# Altium schematic sheet Antenna_Supervisor.SchDoc
size A; sch_PageDescription: sch_PageDescription; sch_PageTitle: sch_PageTitle; Organization: ORGANIZATION; Address1: ADDRESS 1; Address2: ADDRESS 2; Address3: ADDRESS 3; Address4: ADDRESS 4; Revision: -; SheetNumber: 3; SheetTotal: 3; ENG_APP_DATE: --/--/--; DSN_APP_DATE: --/--/--; CHK_APP_DATE: --/--/--; SPICEModelCachePIVZSDOR: <root> / <DocumentId>PIVZSDOR</DocumentId> / <CacheFrame Number="0"> / <Model Name="umk105bj104_v-f" Kind="CKT"> / <Text>* UMK105BJ104_V-F     SPICE MODEL  ( General Type ) / *-------------------------------------------------------------------------------------------------------- / * Model Generated by TAIYO YUDEN Corporation (http://www.ty-top.com) / * Version 1.0 / * TAIYO YUDEN Control No. 170508_120810 / * Copyright(c) 2012 TAIYO YUDEN CO.,LTD. All Rights Reserved. / *-------------------------------------------------------------------------------------------------------- / * / * Products Name : Multilayer Ceramic Capacitors / * / * Characteristics : / *     Capacitance : 0.1 uF , Rated Voltage : 50V , TCC : X5R / *     Case Size : 1.0 x 0.5 / 0.039 x 0.02 [mm/inch] , Thickness : 0.5 / 0.02 [mm/inch] / *     (Conditions: Temperature = 25 degC , DC Bias Current/Voltage = 0A / 0V) / * / * Frequency Range : 40Hz - 3GHz / * / * External Node Assignments : / * / *  1  o---| |---o  2 / * / *-------------------------------------------------------------------------------------------------------- / .SubCkt UMK105BJ104_V-F 1 2 / **************************** / C0 1 110 0.068998u / Cm 1 101 0.01292u / C1 101 102 0.041907u / Rc1 101 102 25.432k / C2 102 103 0.021417u / Rc2 102 103 1.1926k / C3 103 110 0.016759u / Rc3 103 110 12.415 / C2m 1 301 0.022631u / C21 301 302 0.1608u / Rc21 301 302 202.11k / C22 302 303 0.054305u / Rc22 302 303 87.274k / C23 303 304 0.14296u / Rc23 303 304 7.7387k / C24 304 305 0.08092u / Rc24 304 305 2.9339k / C25 305 306 0.04951u / Rc25 305 306 2.1733k / C26 306 307 0.043691u / Rc26 306 307 191.91 / C27 307 308 0.016759u / Rc27 307 308 147.23 / C28 308 309 5027.4p / Rc28 308 309 97.746 / C29 309 110 570.66p / Rc29 309 110 12.365 / Rp0 1 110 5G / L0 110 120 0.23341n / Lm 120 130 0.14222n / L1 120 121 0.036554n / RL1 121 130 1.698 / L2 120 122 0.11188n / RL2 122 130 0.33926 / L3 120 123 1.1401n / RL3 123 130 1.655 / CR 120 124 0.028892u / LR 124 125 0.10347n / RR 125 130 0.14446 / CL 130 140 2.048p / LL 130 140 0.1545n / RL 130 140 189.66 / Rs 140 2 26.069m / **************************** / .ends UMK105BJ104_V-F</Text> / </Model> / </CacheFrame> / </root>
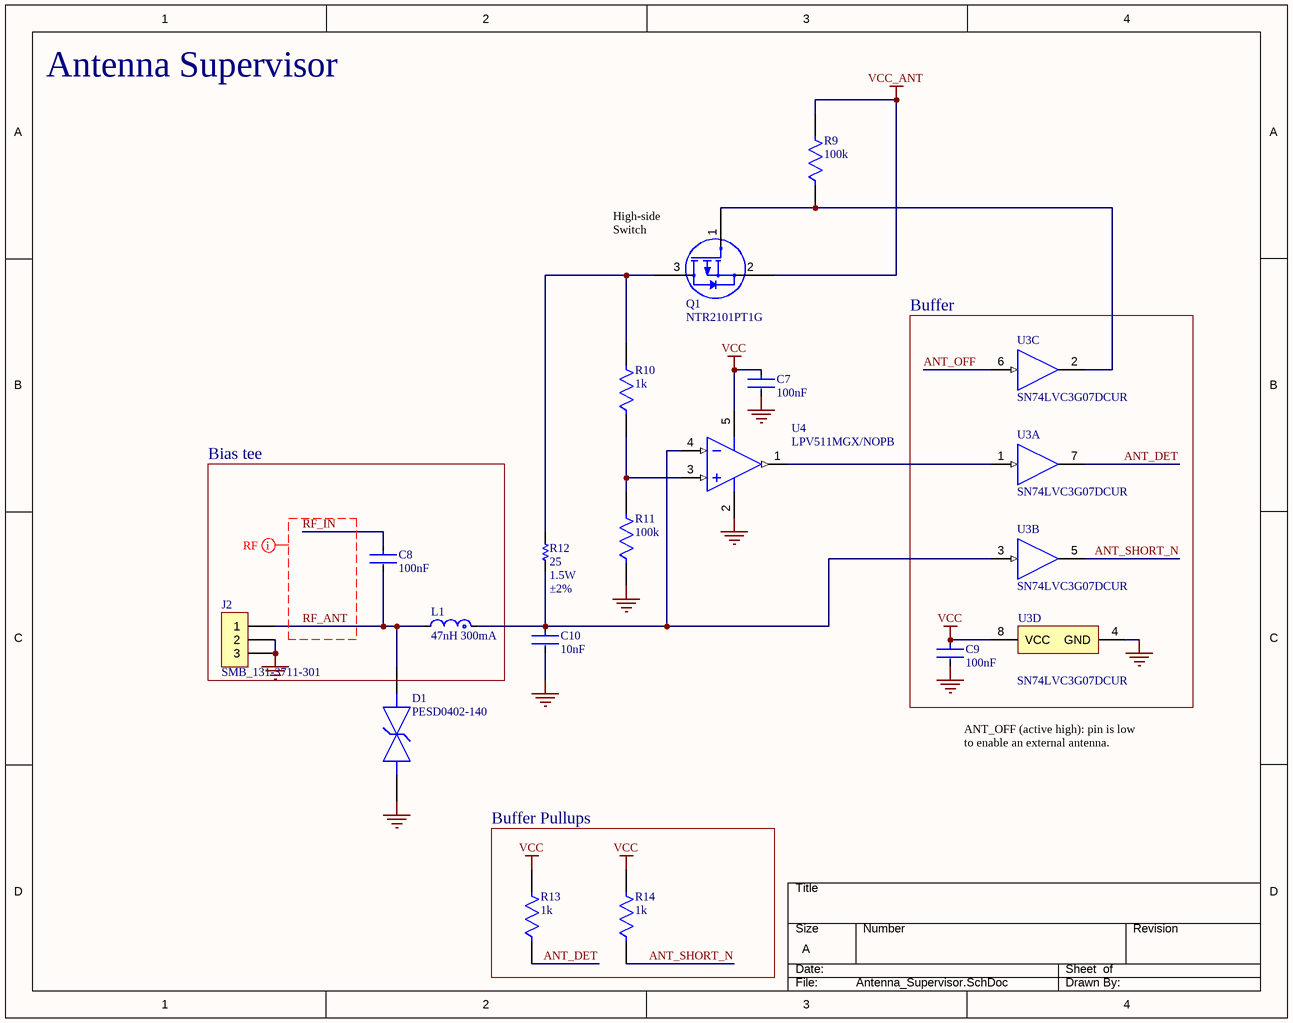
[diagram p0: Antenna_Supervisor.SchDoc]

## Parts
C7  100nF  [FP-0402-L_1_0_0_05-W_0_5-IPC_B]
C8  100nF  [FP-0402-L_1_0_0_05-W_0_5-IPC_B]
C9  100nF  [FP-0402-L_1_0_0_05-W_0_5-IPC_B]
C10  10nF  [FP-GRM033-0_03-IPC_B]
D1  PESD0402-140  [FP-PESD0402-MFG]
J2  SMB_131-3711-301  [CONN_131-3711-301]
L1  47nH 300mA  [FP-LQG15HH_02-IPC_B]
Q1  Manufacturer Part Number: NTR2101PT1G  [SOT23_3pins_300x140x112]  (hidden comment: onsemi_NTR2101PT1G)
R9  100k  [FP-RMCF0402-IPC_C]
R10  1k  [FP-RMCF0402-MFG]
R11  100k  [FP-RMCF0402-IPC_C]
R12  Resistance: 25  Power (Watts): 1.5W  Tolerance: ±2%  [RESC1608X055N]  (hidden comment: Vishay_RCP0603W25R0GEB)
R13  1k  [FP-RMCF0402-MFG]
R14  1k  [FP-RMCF0402-MFG]
U3  SN74LVC3G07DCUR  [DCU0008A_N]  (parts A,B,C,D of 4)
U4  LPV511MGX/NOPB  [DCK0005A_N]

## Blocks framed on the sheet
Buffer: C9 U3
Bias tee: C8 J2 L1
Buffer Pullups: R13 R14

## Nets
GND: C7.2 C9.2 C10.2 D1.1 J2.2 J2.3 R11.1 U3.4(GND) U4.2(V-)
VCC: C7.1 C9.1 R13.2 R14.2 U3.8(VCC) U4.5(V+)
VCC_ANT: Q1.2(S) R9.2
ANT_DET: R13.1 U3.7(1Y)
ANT_OFF: U3.6(3A)
ANT_SHORT_N: R14.1 U3.5(2Y)
RF_ANT: C8.2 D1.2 J2.1 L1.2
RF_IN: C8.1
NetC10_1: C10.1 L1.1 R12.2 U3.3(2A) U4.4(IN-)
NetQ1_1: Q1.1(G) R9.1 U3.2(3Y)
NetQ1_3: Q1.3(D) R10.2 R12.1
NetR10_1: R10.1 R11.2 U4.3(IN+)
NetU3_1: U3.1(1A) U4.1(OUT)

## Layout directives
net class RF: RF_ANT, RF_IN

## Notes on the sheet
- Antenna Supervisor
- (near Q1) High-side Switch
- ANT_OFF (active high): pin is low to enable an external antenna.
- DWG. NO.
- REV.
- SHT.
- THIS DOCUMENT AND THE DATA DISCLOSED HEREIN OR HEREWITH IS THE PROPERTY OF ALTIUM LIMITED AND MAY BE FREELY DISTRIBUTED IN WHOLE. NO RIGHTS ARE RESERVED OR EXPRESS OR IMPLIED WARANTEE GIVEN.
- REVISION
- DESCRIPTION
- DATE
- APPROVED
- ENG:
- APPROVALS
- PROJECT
- DSN:
- CHK:
- REFERENCE DOCUMENTS
- PROJECT REVISION:
- TITLE
- DOCUMENT REVISION:
- DESIGN ITEM:
- BOM:
- FAB DWG:
- PCB DWG:
- ASSY DWG:
- SCALE:
- SIZE
- B
- CAGE CODE
- FILE NAME
- DWG NO.
- SHEET
- OF
- REV

## Library data of the parts
C7-C9 = CMP-14477-000330-2: None; Voltage Rating (DC): 50V; Dielectric: X5R; Tolerance: 10%; RoHS Compliant: Yes; Termination: SMD/SMT; Packaging: Tape and Reel; Capacitance: 100nF; Height: 0.5mm; Halogen Free: Halogen Free; Case Code (Metric): 1005; Width: 0.02inch; Max Operating Temperature: 85°C; Voltage Rating: 50V; Min Operating Temperature: -55°C; Package Quantity: 10000; Case/Package: 0402; Case Code (Imperial): 0402; Length: 0.039inch; Thickness: 0.022inch; Mount: Surface Mount
C10 = CMP-03422-000501-1: CAP CER 10000PF 16V X7R 0402; Manufacturer Part Number: CC0402KRX7R7BB103; Manufacturer: YAGEO; Automotive Grade: NA; Material: Ceramic; Tolerance: 0.1; Temperature Coefficient: 30ppm/°C; Description: CC0402 10 nF X7R 10.00% 16 V; Temperature Range Low: -55°C; Temperature Range High: +125°C; Mouser Description: 0402 10 nF 16 V ±10 % Tolerance X7R SMT Multilayer Ceramic Capacitor; Footprint Url: http://www.yageo.com/exep/pages/download/literatures/UPY-C_GEN_24.pdf; Category: Cap; RoHS: TRUE; Capacitance: 10 nF; ComponentLink2Description: Datasheet; Ipc Land Pattern Name: CAPC10050X50; Value: 10 nF; Automotive: No; ComponentLink2URL: http://www.yageo.com/documents/recent/UPY-GP_NP0_16V-to-50V_16.pdf; Device Class L1: Passive Components; Height: 0.55mm; Temperature Characteristic: X7R; Package: CC0402; Voltage Rating: 16 V; Device Class L3: Ceramic Capacitors; Lead Free: Yes; Device Class L2: Capacitors; Digikey Description: CAP CER 10000PF 16V X7R 0402; Octopart: https://octopart.com/cc0402krx7r7bb103-yageo-192895; Temperature: -55°C to +125°C
D1 = CMP-08607-000011-1: TVS DIODE 14V 40V 0402; Manufacturer: Littelfuse Inc.; Automotive Grade: Grade 1; Capacitance: 0.25pF; Value: 0.25pF; Direction: Bidirectional; Number Of Channels: 1; Temperature Range Low: -55°C; Lead Free: Yes; Temperature: -55°C to +125°C; Digikey Description: TVS DIODE 14V 40V 0402; Automotive: Yes; Device Class L2: TVS Diodes; Reverse Standoff Voltage: 14V; Device Class L1: Circuit Protection; Ipc Land Pattern Name: DIOC10050X33; Manufacturer Part Number: PESD0402-140; Breakdown Voltage: 14V; Height: 0.43mm; Clamping Voltage: 40V; RoHS: TRUE; Temperature Range High: +125°C; Device Class L3: unset; Octopart: https://octopart.com/pesd0402-140-littelfuse-74215061; Package: PESD0402; ComponentLink2URL: https://www.littelfuse.com/~/media/electronics/datasheets/polymer_esd_suppressors/littelfuse_polymer_esd_suppressor_pesd_catalog_datasheet.pdf.pdf; Category: Diode; ComponentLink2Description: Datasheet
J2 = CONN_131-3711-301: Rf Coaxial Board Mount Connector; Manufacturer: Bel Cinch; Body Material: Brass; Plating: Nickel; Body Plating: Gold; Dielectric Material: PTFE; Impedance: 50R; Voltage Rating: 335V; Gender: Female; Frequency: 4Hz; Connector Type: SMB,Male Pin; Max Frequency: 4GHz; Polarity: Reverse; Operating Frequency: 0 to 4 Hz to GHz; Supplier 1: Digi-Key; Manufacturer Part Number: 131-3711-301; RoHS: Yes; Category: RF / Coaxial Connectors; Stock 1: 475; Pricing 1: 1=7.75000, 10=7.00900, 25=6.62160, 50=6.46000, 100=6.13700, 250=5.49100, 500=5.16800, 1000=4.52200 (USD); Mount: Surface Mount; Case/Package: SMA; Contact Material: Brass; Contact Plating: Gold,Nickel; Housing Color: Gold; Shell Plating: Nickel; Center Contact Plating: Gold; Min Operating Temperature: -65°C; Max Operating Temperature: 165°C; Package Quantity: 25; Packaging: Bulk; Fastening Type: SNAP-ON; Termination: Solder; Orientation: Right Angle; ComponentLink1URL: http://www.mouser.com/Search/include/RoHSCompliant.aspx?qs=sxnx5FoGSWlI%252bs7K%252boh9Yg%3d%3d&src-supplier=Mouser; ComponentLink1Description: http://www.mouser.com/Search/include/RoHSCompliant.aspx?qs=sxnx5FoGSWlI%252bs7K%252boh9Yg%3d%3d&src-supplier=Mouser; ComponentLink2URL: http://www.mouser.com/Search/include/RoHSCompliant.aspx?qs=BzWiDxlKIe%2fRhe5ZDRBb2Q%3d%3d&src-supplier=Mouser; ComponentLink2Description: http://www.mouser.com/Search/include/RoHSCompliant.aspx?qs=BzWiDxlKIe%2fRhe5ZDRBb2Q%3d%3d&src-supplier=Mouser; ComponentLink3URL: http://www.onlinecomponents.com/datasheet/1313711301.aspx?p=11276490&src-supplier=Onlinecomponents.com; ComponentLink3Description: http://www.onlinecomponents.com/datasheet/1313711301.aspx?p=11276490&src-supplier=Onlinecomponents.com; ComponentLink4URL: http://www.mouser.com/Search/include/RoHSCompliant.aspx?qs=sxnx5FoGSWlgU0HI%252bkNgTA%3d%3d&src-supplier=Mouser; ComponentLink4Description: http://www.mouser.com/Search/include/RoHSCompliant.aspx?qs=sxnx5FoGSWlgU0HI%252bkNgTA%3d%3d&src-supplier=Mouser; ComponentLink5URL: http://www.mouser.com/Search/include/RoHSCompliant.aspx?qs=p2XSgoD%252b2ikka7OcbAcBow%3d%3d&src-supplier=Mouser; ComponentLink5Description: http://www.mouser.com/Search/include/RoHSCompliant.aspx?qs=p2XSgoD%252b2ikka7OcbAcBow%3d%3d&src-supplier=Mouser; ComponentLink6URL: http://www.mouser.com/Search/include/RoHSCompliant.aspx?qs=CoHYZihNMM5AOHZHjTCMkA%3d%3d&src-supplier=Mouser; ComponentLink6Description: http://www.mouser.com/Search/include/RoHSCompliant.aspx?qs=CoHYZihNMM5AOHZHjTCMkA%3d%3d&src-supplier=Mouser; ComponentLink7URL: http://www.mouser.com/Search/include/RoHSCompliant.aspx?qs=hJAXt0VUbWsyDbF0CdNvSg%3d%3d&src-supplier=Mouser; ComponentLink7Description: http://www.mouser.com/Search/include/RoHSCompliant.aspx?qs=hJAXt0VUbWsyDbF0CdNvSg%3d%3d&src-supplier=Mouser; Supplier Part Number 1: J10507-ND
L1 = CMP-06042-015783-1: Multilayer type RF Inductor 47nH ±5% 0.72Ω 300mA 0402; Core Material: Air; DC Resistance (DCR): 720mR; DC Current: 200mA; Shielding: Unshielded; Self Resonant Frequency: 1GHz; Q Factor: 8; Test Frequency: 100MHz; Tolerance: 5%; Packaging: Tape and Reel; Case Code (Imperial): 0402; Max Operating Temperature: 125°C; Military Standard: Not; Length: 1mm; Radiation Hardening: No; Height: 0.5mm; Min Operating Temperature: -55°C; Width: 0.02inch; Inductance: 47nH; Lead Free: Lead Free; Termination: SMD/SMT; Height - Seated (Max): 0.022inch; Rated Current-Max: 200mA; Case/Package: 0402; Max DC Current: 200mA; Series: LQG15HS; Case Code (Metric): 1005; Mount: Surface Mount; Current Rating: 200mA; Depth: 0.55mm; Package Quantity: 1
Q1 = XQR-CMP-00012-1: MOSFET, P-CH, 8VDS, 3.7A ID, 0.052 OHM RDS(ON)@4.5VGS/3.5A, SOT-23-3; Manufacturer: onsemi; Internal Part Number: 839-00735-00; Power Dissipation (Max): 960mW (Ta); Drive Voltage (Max Rds On, Min Rds On): 1.8V, 4.5V; Drain to Source Voltage (Vdss): 8 V; Input Capacitance (Ciss) (Max) @ Vds: 1173 pF @ 4 V; Rds On (Max) @ Id, Vgs: 52mOhm @ 3.5A, 4.5V; FET Type: P-Channel; Current - Continuous Drain (Id) @ 25°C: 3.7A (Ta); RoHS: Yes; Category: FETs, MOSFETs - Single; Case/Package: TO-236-3, SC-59, SOT-23-3; Max Operating Temperature: 150°C; Mounting Type: Surface Mount; Technology: MOSFET (Metal Oxide); Supplier Part Number 1: NTR2101PT1GOSCT-ND; Min Operating Temperature: -55°C; Datasheet URL: https://www.digikey.com/en/products/detail/onsemi/ntr2101pt1g/687095; Supplier 1: Digikey
R9 R11 = CMP-2000-06984-2: 100kΩ ±1% 0.063W 0402 Thick Film Chip Resistor AEC-Q200 compliant; Max Power Dissipation: 63mW; Resistance: 100kR; Temperature Coefficient: 100ppm/°C; Power Rating: 62.5mW; Packaging: Tape and Reel; Size Code: 0402; Resistor Type: Thick Film; Features: Automotive AEC-Q200; Case Code (Metric): 1005; RoHS Compliant: Yes; Length: 1mm; Radiation Hardening: No; Military Standard: Not; Case Code (Imperial): 0402; Depth: 0.5mm; Max Operating Temperature: 155°C; Lead Free: Lead Free; Case/Package: 0402; Tolerance: 1%; Construction: Rectangular; Number of Terminations: 2; Mount: Surface Mount; Min Operating Temperature: -55°C; Width: 0.02inch; Series: RMCF; Contact Plating: Tin; Height: 0.016inch
R10 R13 R14 = CMP-26527-000026-1: 1kΩ ±1% 0.063W 0402 Thick Film Chip Resistor AEC-Q200 compliant; Resistance: 1kR; Temperature Coefficient: 100ppm/°C; Power Rating: 63mW; Length: 1mm; RoHS Compliant: Yes; Construction: Rectangular; Height: 0.016inch; Size Code: 0402; Lead Free: Lead Free; Radiation Hardening: No; Tolerance: 1%; Width: 0.02inch; Military Standard: Not; Resistor Type: Thick Film; Number of Terminations: 2; Min Operating Temperature: -55°C; Max Operating Temperature: 155°C; Depth: 0.5mm; Features: Automotive AEC-Q200; Packaging: Tape and Reel; Case Code (Metric): 1005; Mount: Surface Mount; Contact Plating: Tin; Max Power Dissipation: 63mW; Case/Package: 0402; Case Code (Imperial): 0402; Series: RMCF
R12 = RES-CMP-00725-3: RES, 25 OHM, 2%, 1.5W, 150PPM/C, 0603; Internal Part Number: 822-00198-00; Manufacturer: Vishay; Temperature Coefficient: ±150ppm/°C; Datasheet URL: https://www.digikey.com/en/products/detail/vishay-dale/RCP0603W25R0GEB/5481868?s=N4IgTCBcDaIEoGEAKAGAbCgzAdTAVjhQHEBRAIRAF0BfIA; Supplier Part Number 1: 541-2654-1-ND; Features: Moisture Resistant; Category: Chip Resistor - Surface Mount; Size / Dimension: 0.063" L x 0.032" W (1.60mm x 0.81mm); Supplier 1: Digikey; Height: 0.023" (0.58mm); Case/Package: 0603 (1608 Metric); RoHS: Yes; Composition: Thick Film; Max Operating Temperature: 155°C; Min Operating Temperature: -65°C; Series: RCP; Manufacturer Part Number: RCP0603W25R0GEB
U3 = CMP-0859-00615-3: Triple Buffer/Driver With Open-Drain Output, DCU0008A, LARGE T&R; Manufacturer: Texas Instruments; VCC(Max)(V): 5.5; Sub-Family: Non-Inverting Buffer/Driver; Logic: True; tpd @ Nom Voltage(Max)(ns): 8.3,4.8,4.2,3.4; Output Type: CMOS; F @ Nom Voltage(Max)(Mhz): 150; Technology Family: LVC; ICC @ Nom Voltage(Max)(mA): 0.01; Voltage(Nom)(V): 1.8,2.5,3.3,5; Schmitt Trigger: No; VCC(Min)(V): 1.65; Bits(#): 3; Input Type: CMOS/TTL; Rating: Catalog; Output Drive (IOL/IOH)(Max)(mA): 32/-32; Generic Part Number: SN74LVC3G07; PackageReference: DCU0008A; 3-State Output: No; DatasheetVersion: SCES365K; Operating Temperature Range(C): -40 to 125,-40 to 85
U4 = CMP-0055-01065-3: micropower Rail-to-Rail Input and Output Operational Amplifier, 5-pin SC-70, Pb-Free; Manufacturer: Texas Instruments; CompType: Amplifiers; PackageTopMarking: A91*XTT; PowerWise: Y; ComponentLink1URL: http://www.ti.com/general/docs/lit/getliterature.tsp?genericPartNumber=LPV511&fileType=pdf; Code_JEDEC: MO-203-AA; RoHS: Y; Code_IPC: SOT353-5; PinCount: 5; PackageDescription: Molded SC-70, 2 x 1.25 x .9mm, 5 Lead, 0.65mm Pitch; ComponentLink1Description: Datasheet URL; Package Reference: DCK0005A; Code_JEITA: SC-88A